# EAGLE schematic uzed-carrier (EAGLE 8.3.1)

## Sheet 1 of 2: Headers
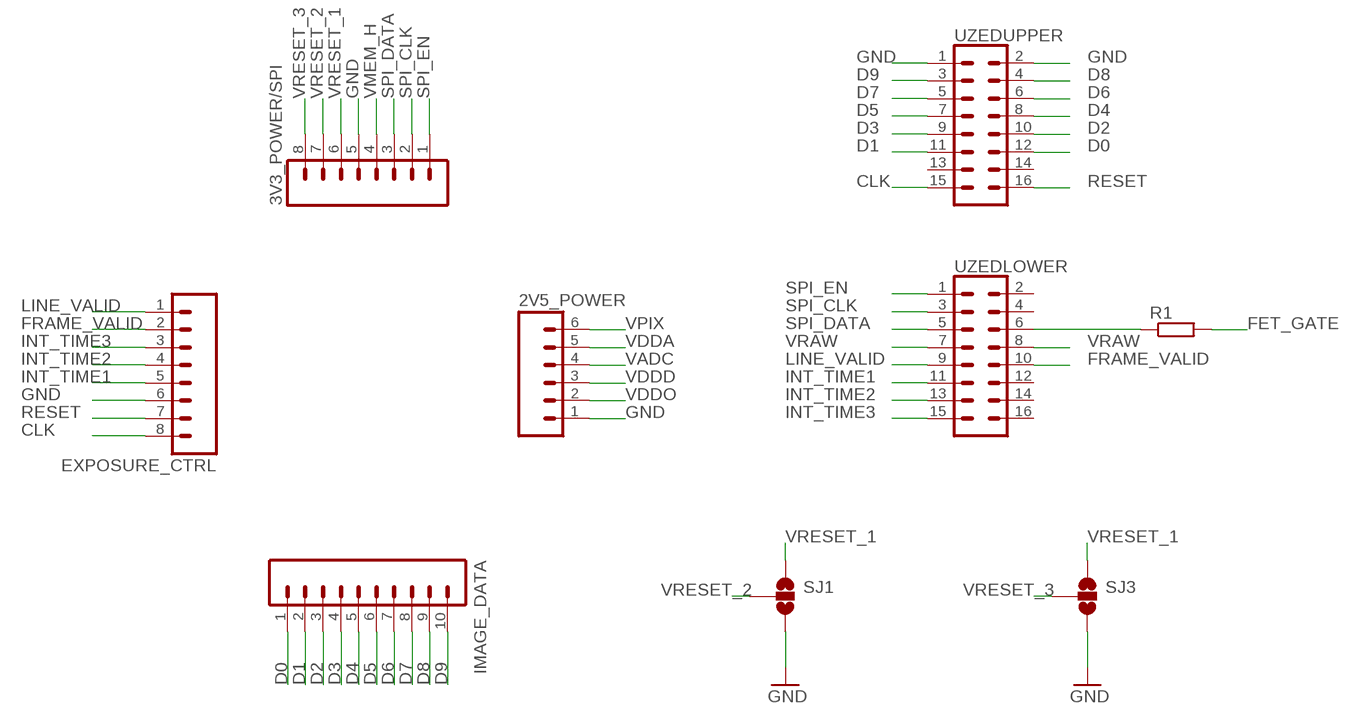
[diagram p0: schematic, sheet 1]

### Parts
2V5_POWER  M06SILK_FEMALE_PTH  [1X06]
3V3_POWER/SPI  M08  [1X08_ROUND]
EXPOSURE_CTRL  M08  [1X08_ROUND]
IMAGE_DATA  M10SILK_FEMALE_PTH  [1X10]
R1  R-EU_M1206  [M1206]
SJ1  SOLDERJUMPER_2WAYS  [SJ_3]
SJ3  SOLDERJUMPER_2WAYS  [SJ_3]
UZEDLOWER  CONN_08X2  [2X8]
UZEDUPPER  CONN_08X2  [2X8]

### Nets
CLK: EXPOSURE_CTRL.8 UZEDUPPER.15
D0: IMAGE_DATA.1 UZEDUPPER.12
D1: IMAGE_DATA.2 UZEDUPPER.11
D2: IMAGE_DATA.3 UZEDUPPER.10
D3: IMAGE_DATA.4 UZEDUPPER.9
D4: IMAGE_DATA.5 UZEDUPPER.8
D5: IMAGE_DATA.6 UZEDUPPER.7
D6: IMAGE_DATA.7 UZEDUPPER.6
D7: IMAGE_DATA.8 UZEDUPPER.5
D8: IMAGE_DATA.9 UZEDUPPER.4
D9: IMAGE_DATA.10 UZEDUPPER.3
FET_GATE: R1.2 ; also sheet 2
FRAME_VALID: EXPOSURE_CTRL.2 UZEDLOWER.10
GND: 2V5_POWER.1 3V3_POWER/SPI.5 EXPOSURE_CTRL.6 SJ1.3 SJ3.3 UZEDUPPER.1 UZEDUPPER.2 ; also sheet 2
INT_TIME1: EXPOSURE_CTRL.5 UZEDLOWER.11
INT_TIME2: EXPOSURE_CTRL.4 UZEDLOWER.13
INT_TIME3: EXPOSURE_CTRL.3 UZEDLOWER.15
LINE_VALID: EXPOSURE_CTRL.1 UZEDLOWER.9
N$1: R1.1 UZEDLOWER.6
RESET: EXPOSURE_CTRL.7 UZEDUPPER.16
SPI_CLK: 3V3_POWER/SPI.2 UZEDLOWER.3
SPI_DATA: 3V3_POWER/SPI.3 UZEDLOWER.5
SPI_EN: 3V3_POWER/SPI.1 UZEDLOWER.1
VADC: 2V5_POWER.4 ; also sheet 2
VDDA: 2V5_POWER.5 ; also sheet 2
VDDD: 2V5_POWER.3 ; also sheet 2
VDDO: 2V5_POWER.2 ; also sheet 2
VMEM_H: 3V3_POWER/SPI.4 ; also sheet 2
VPIX: 2V5_POWER.6 ; also sheet 2
VRAW: UZEDLOWER.7 UZEDLOWER.8 ; also sheet 2
VRESET_1: 3V3_POWER/SPI.6 SJ1.1 SJ3.1 ; also sheet 2
VRESET_2: 3V3_POWER/SPI.7 SJ1.2
VRESET_3: 3V3_POWER/SPI.8 SJ3.2
Unconnected: UZEDLOWER.2 UZEDLOWER.4 UZEDLOWER.12 UZEDLOWER.14 UZEDLOWER.16 UZEDUPPER.13 UZEDUPPER.14

## Sheet 2 of 2: Regulators
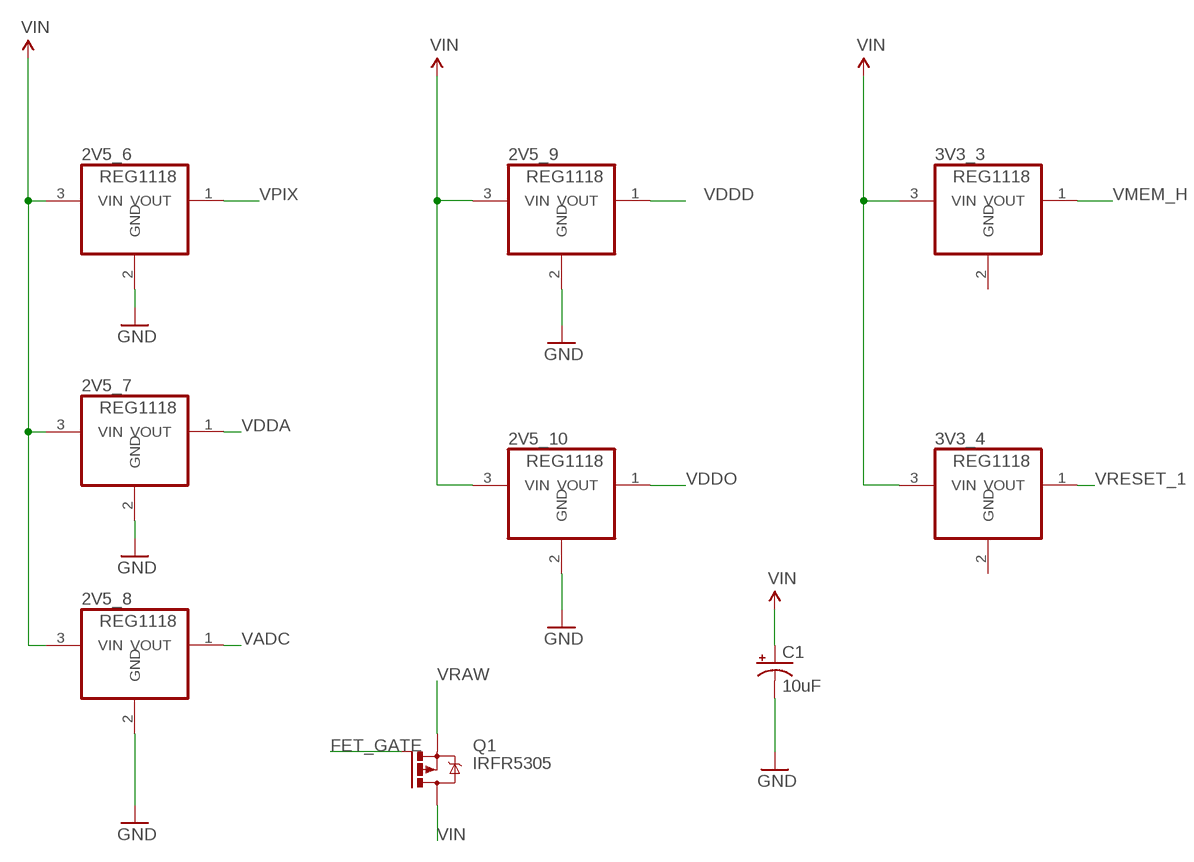
[diagram p1: schematic, sheet 2]

### Parts
2V5_6  REG1118  [SOT223]
2V5_7  REG1118  [SOT223]
2V5_8  REG1118  [SOT223]
2V5_9  REG1118  [SOT223]
2V5_10  REG1118  [SOT223]
3V3_3  REG1118  [SOT223]
3V3_4  REG1118  [SOT223]
C1  10uF  10UF-POLAR-EIA3216-16V-10%(TANT)  [EIA3216]
Q1  IRFR5305  [D-PAK_TO252AA]

### Nets
FET_GATE: Q1.1(G) ; also sheet 1
GND: 2V5_6.2(GND) 2V5_7.2(GND) 2V5_8.2(GND) 2V5_9.2(GND) 2V5_10.2(GND) C1.- ; also sheet 1
VADC: 2V5_8.1(VOUT) ; also sheet 1
VDDA: 2V5_7.1(VOUT) ; also sheet 1
VDDD: 2V5_9.1(VOUT) ; also sheet 1
VDDO: 2V5_10.1(VOUT) ; also sheet 1
VIN: 2V5_6.3(VIN) 2V5_7.3(VIN) 2V5_8.3(VIN) 2V5_9.3(VIN) 2V5_10.3(VIN) 3V3_3.3(VIN) 3V3_4.3(VIN) C1.+ Q1.4(D)
VMEM_H: 3V3_3.1(VOUT) ; also sheet 1
VPIX: 2V5_6.1(VOUT) ; also sheet 1
VRAW: Q1.3(S) ; also sheet 1
VRESET_1: 3V3_4.1(VOUT) ; also sheet 1

## Power pins joined to a net without a drawn wire
GND: 3V3_3.2(GND) 3V3_4.2(GND)

## Library data of the parts
2V5_6-2V5_10 3V3_3 3V3_4 = burr-brown:REG1118: 800mA Low Dropout (LDO) Positive Regulator with Current Source and Sink Capability; MPN: REG1118-2.85/2K5G4; OC_FARNELL: unknown; OC_NEWARK: 14M2185
2V5_POWER = SparkFun-Connectors:M06: Header 6 Standard 6-pin 0.1" header. Use with straight break away headers (SKU : PRT-00116), right angle break away headers (PRT-00553), swiss pins (PRT-00743), machine pins (PRT-00117), and female headers (PRT-00115). Molex polarized connector foot print use with SKU : PRT-08094 with associated crimp pins and housings. NOTES ON THE VARIANTS LOCK and LOCK_LONGPADS... This footprint was designed to help hold the alignment of a through-hole component (i.e. 6-pin header) while soldering it into place. You may notice that each hole has been shifted either up or down by 0.005 of an inch from it's more standard position (which is a perfectly straight line). This slight alteration caused the pins (the squares in the middle) to touch the edges of the holes. Because they are alternating, it causes a "brace" to hold the component in place. 0.005 has proven to be the perfect amount of "off-center" position when using our standard breakaway headers. Although looks a little odd when you look at the bare footprint, once you have a header in there, the alteration is very hard to notice. Also,if you push a header all the way into place, it is covered up entirely on the bottom side. This idea of altering the position of holes to aid alignment will be further integrated into the Sparkfun Library for other footprints. It can help hold any component with 3 or more connection pins.; PROD_ID: CONN-08437
3V3_POWER/SPI EXPOSURE_CTRL = SparkFun-Connectors:M08: Header 8 Standard 8-pin 0.1" header. Use with straight break away headers (SKU : PRT-00116), right angle break away headers (PRT-00553), swiss pins (PRT-00743), machine pins (PRT-00117), and female headers (PRT-00115).; PROD_ID: CONN-08437
C1 = SparkFun-Capacitors:10UF-POLAR: 10.0µF polarized capacitors A capacitor is a passive two-terminal electrical component used to store electrical energy temporarily in an electric field.; PROD_ID: CAP-00811
IMAGE_DATA = SparkFun-Connectors:M10: Header 10 Standard 10-pin 0.1" header. Use with straight break away headers (SKU : PRT-00116), right angle break away headers (PRT-00553), swiss pins (PRT-00743), machine pins (PRT-00117), and female headers (PRT-00115).; PROD_ID: CONN-11563
Q1 = transistor-power:IRF?5305: HEXFET Power MOSFET Source: http://www.irf.com/product-info/datasheets/data/irfr5305pbf.pdf
R1 = rcl:R-EU_: RESISTOR, European symbol
SJ1 SJ3 = SparkFun-Retired:SOLDERJUMPER_2WAY: Solder Jumper 2 way solder jumper
UZEDLOWER UZEDUPPER = SparkFun-Connectors:CONN_08X2: Multi connection point. Often used as Generic Header-pin footprint for 0.1 inch spaced/style header connections You can populate with any combo of single row headers, but if you'd like an exact match, check this: Header - 2x8 (Male, 0.1") <https://www.sparkfun.com/products/13156> (PRT-13156) On any of the 0.1 inch spaced packages, you can populate with these: Break Away Headers - Straight <https://www.sparkfun.com/products/116> (PRT-00116) Break Away Male Headers - Right Angle <https://www.sparkfun.com/products/553> (PRT-00553) Female Headers <https://www.sparkfun.com/products/115> (PRT-00115) Break Away Headers - Machine Pin <https://www.sparkfun.com/products/117> (PRT-00117) Break Away Female Headers - Swiss Machine Pin <https://www.sparkfun.com/products/743> (PRT-00743)